# Altium schematic sheet Sheet1.SchDoc
size A4
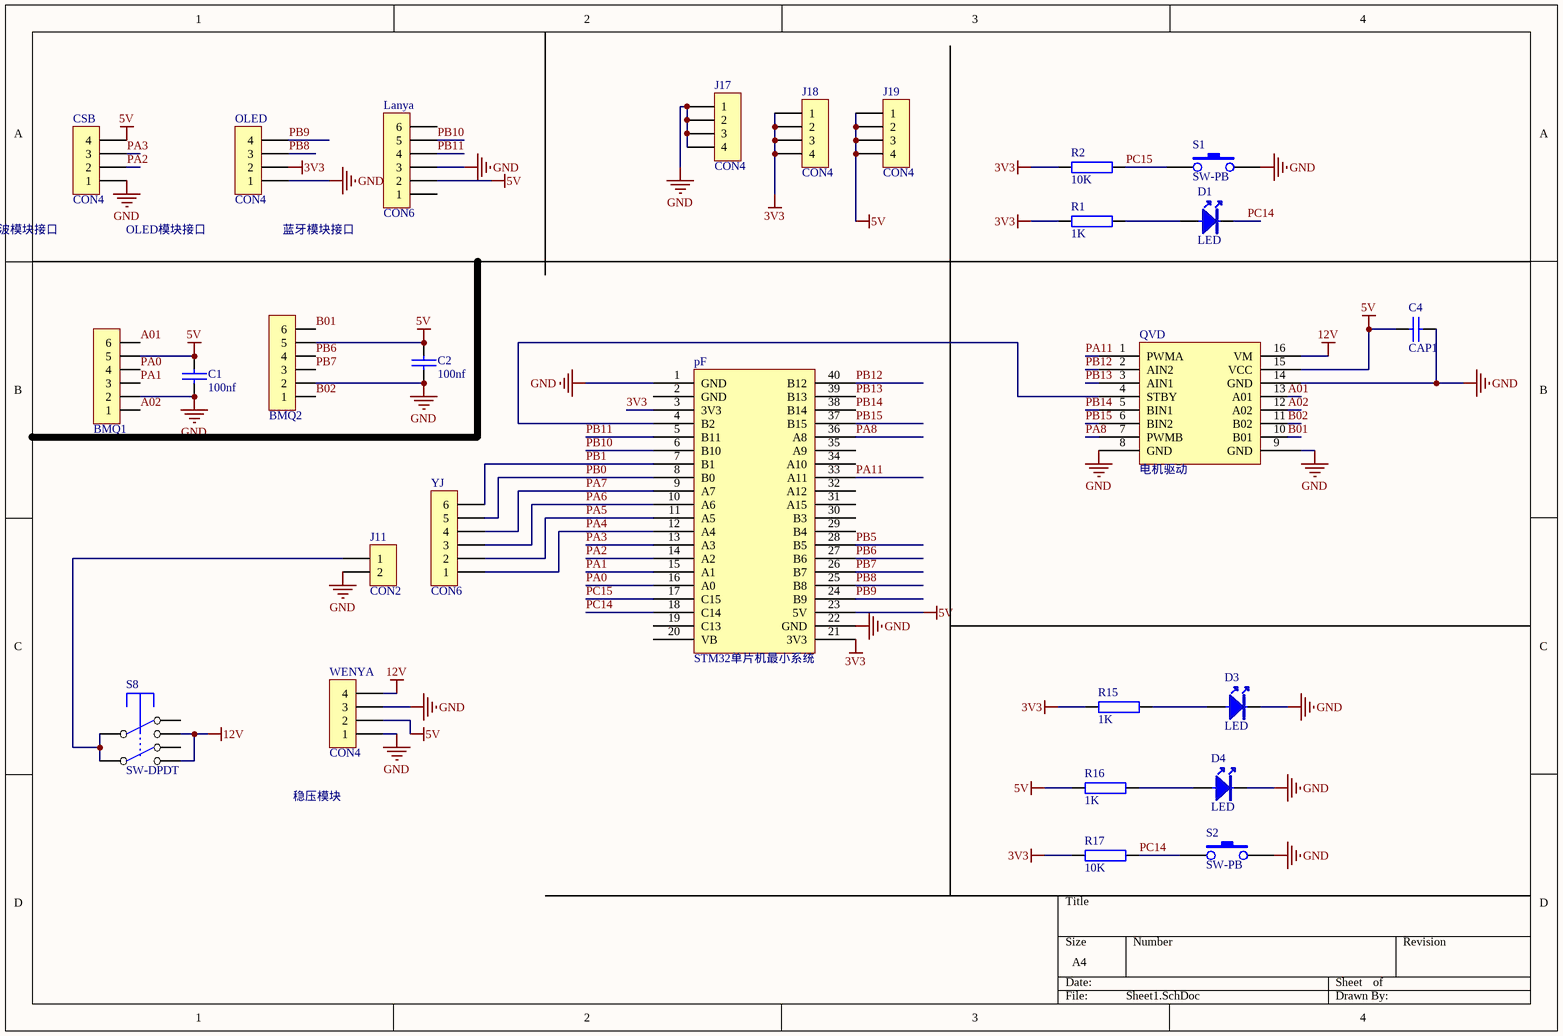
[diagram p0: Sheet1.SchDoc]

## Parts
BMQ1  HDR-1X6  [XH2.54-WI-6P]  (value not drawn)
BMQ2  HDR-1X6  [XH2.54-WI-6P]  (value not drawn)
C1  100nf  [0603]
C2  100nf  [0603]
C4  CAP1  [0603]
CSB  CON4  [HDR2.54-M-LI-4P]
D1  LED  [LED_0805]
D3  LED  [LED_0805]
D4  LED  [LED_0805]
J11  CON2  [KF128-5.08-2P]
J17  CON4  [sip-4]
J18  CON4  [sip-4]
J19  CON4  [sip-4]
Lanya  CON6  [HDR2.54-M-LI-6P]
OLED  CON4  [OLED]
p  STM32单片机最小系统  [PCBComponent_1 - duplicate]  (part F of 6)
QVD  电机驱动  [DIP16P]
R1  1K  [0603]
R2  10K  [0603]
R15  1K  [0603]
R16  1K  [0603]
R17  10K  [0603]
S1  SW-PB  [SW6*6]
S2  SW-PB  [SW6*6]
S8  SW-DPDT  [SWH7*7]
WENYA  CON4  [WEI YA]
YJ  CON6  [sip-6]

## Nets
3V3: J18.1 J18.2 J18.3 J18.4 OLED.2 p.3(3V3) p.21(3V3) R1.1 R2.1 R15.1 R17.1
5V: BMQ1.5 BMQ2.5 C1.1 C2.1 C4.1 CSB.4 J19.1 J19.2 J19.3 J19.4 Lanya.2 p.23(5V) QVD.15(VCC) R16.1 WENYA.2
12V: QVD.16(VM) S8.3 S8.4 WENYA.4
GND: BMQ1.2 BMQ2.2 C1.2 C2.2 C4.2 CSB.1 D3.2 D4.2 J11.2 J17.1 J17.2 J17.3 J17.4 Lanya.3 OLED.1 p.1(GND) p.22(GND) QVD.8(GND) QVD.9(GND) QVD.14(GND) S1.2 S2.2 WENYA.1 WENYA.3
A01: BMQ1.6 QVD.13(A01)
A02: BMQ1.1 QVD.12(A02)
B01: BMQ2.6 QVD.10(B01)
B02: BMQ2.1 QVD.11(B02)
PA0: BMQ1.4 p.16(A0)
PA1: BMQ1.3 p.15(A1)
PA2: CSB.2 p.14(A2)
PA3: CSB.3 p.13(A3)
PA4: p.12(A4) YJ.1
PA5: p.11(A5) YJ.2
PA6: p.10(A6) YJ.3
PA7: p.9(A7) YJ.4
PA8: p.36(A8) QVD.7(PWMB)
PA11: p.33(A11) QVD.1(PWMA)
PB0: p.8(B0) YJ.5
PB1: p.7(B1) YJ.6
PB5: p.28(B5)
PB6: BMQ2.4 p.27(B6)
PB7: BMQ2.3 p.26(B7)
PB8: OLED.3 p.25(B8)
PB9: OLED.4 p.24(B9)
PB10: Lanya.5 p.6(B10)
PB11: Lanya.4 p.5(B11)
PB12: p.40(B12) QVD.2(AIN2)
PB13: p.39(B13) QVD.3(AIN1)
PB14: p.38(B14) QVD.5(BIN1)
PB15: p.37(B15) QVD.6(BIN2)
PC14: D1.2 p.18(C14) R17.2 S2.1
PC15: p.17(C15) R2.2 S1.1
NetD1_1: D1.1 R1.2
NetD3_1: D3.1 R15.2
NetD4_1: D4.1 R16.2
NetJ11_1: J11.1 S8.2 S8.5
Netp_4: p.4(B2) QVD.4(STBY)

Not connected (* = marked no-connect by the designer): Lanya 1 6; p 2(GND) 19(C13) 20(VB) 29(B4) 30(B3) 31(A15) 32(A12) 34(A10) 35(A9); S8 1 6

## Notes on the sheet
- (near CSB) 超声波模块接口
- (near OLED) OLED模块接口
- (near Lanya) 蓝牙模块接口
- 稳压模块

## Library data of the parts
BMQ1 BMQ2 = Header 6: 6P接插件; 版权归属: 封装库来自淘宝 ID：黄晶宝石; BOM名称: 6P接插件; 学习资源: https://shop463601444.taobao.com
C1 C2 = CAP1
CSB J17-J19 OLED WENYA = CON4: Connector
J11 = CON2: Connector
Lanya YJ = CON6: Connector
p QVD = Component_1
R1 R2 R15-R17 = RES: 电阻